# EAGLE design MainBoard (EAGLE 9.6.2)

## Sheet 1 of 4
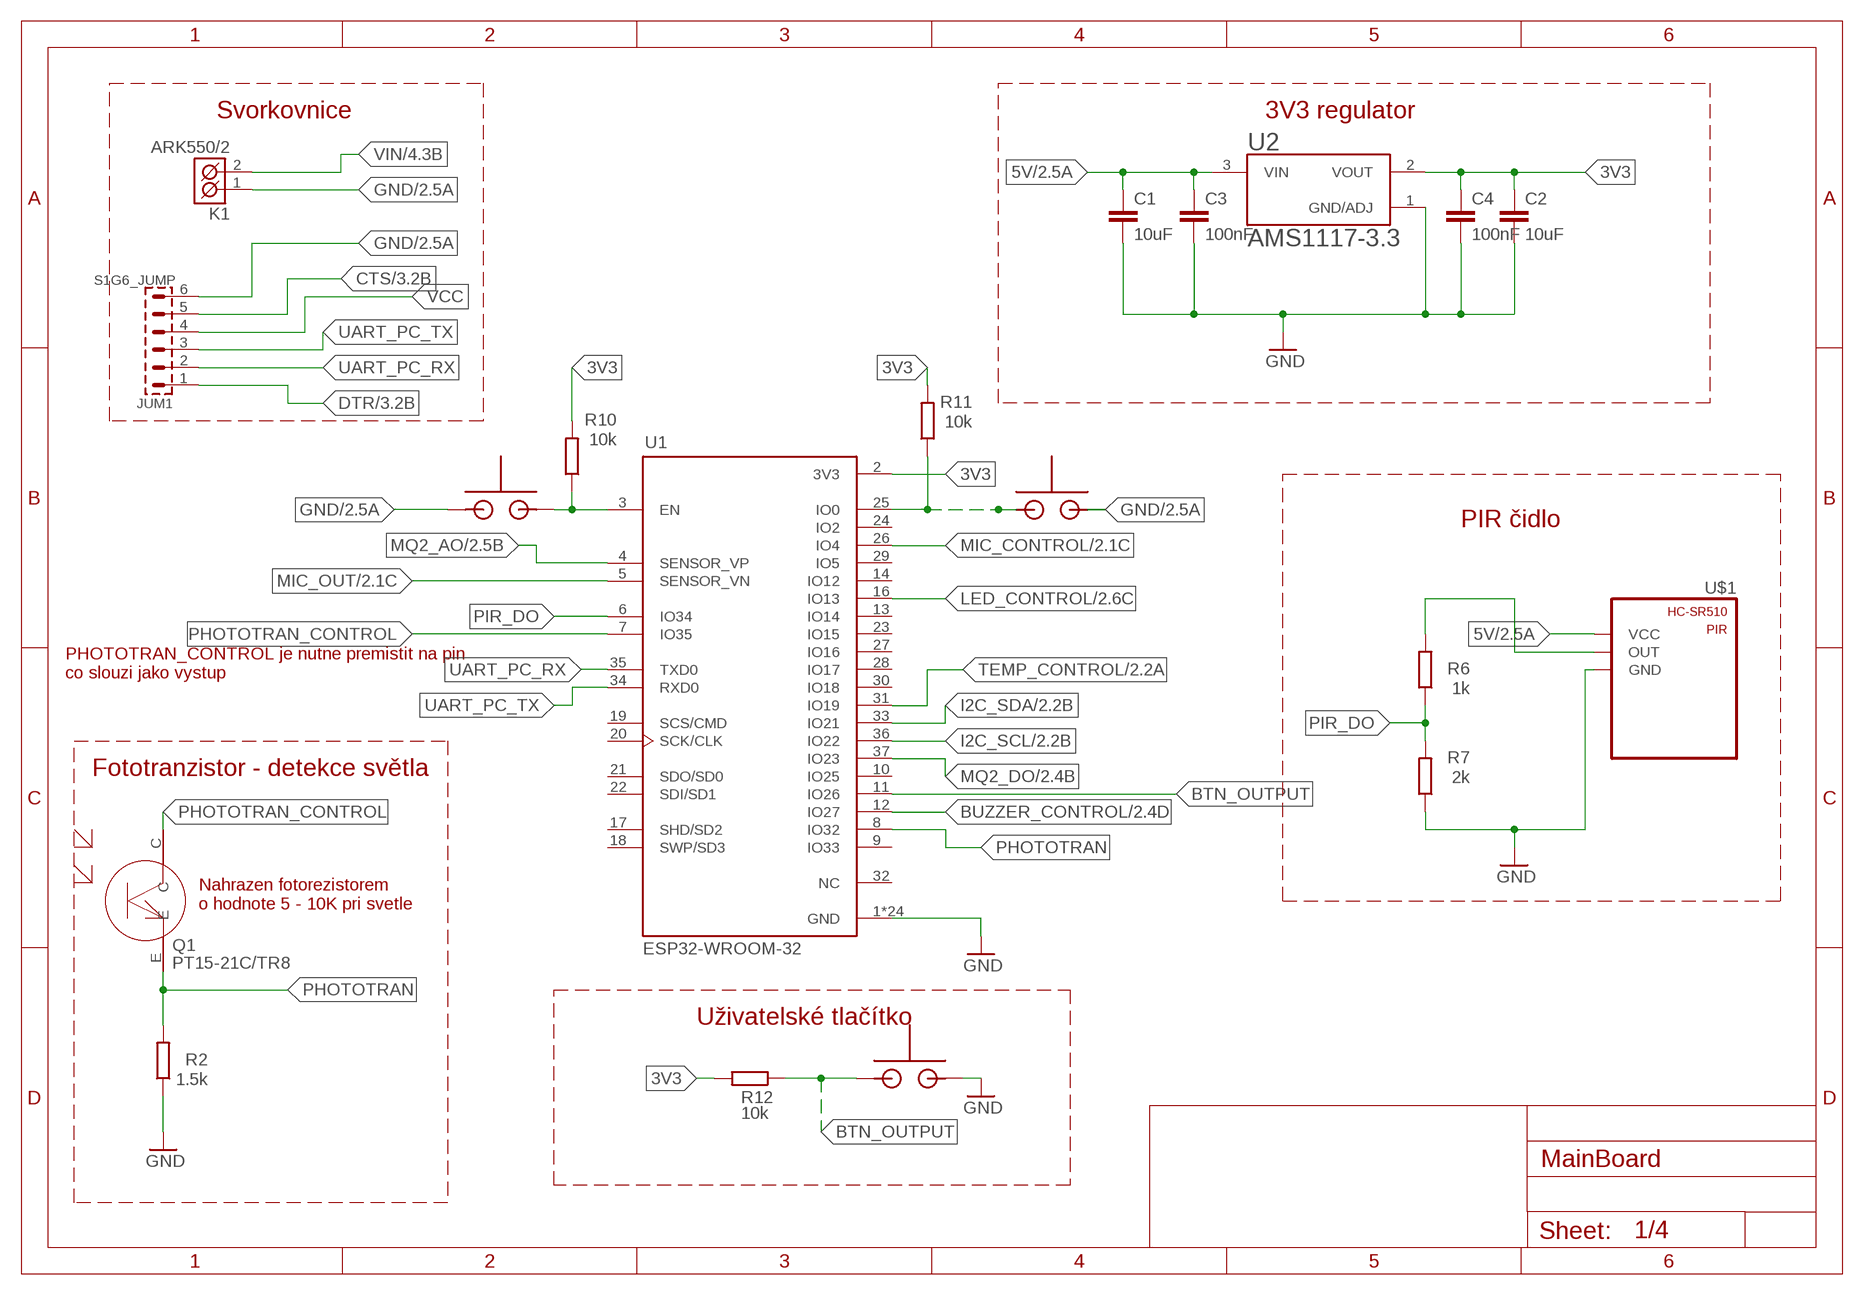
[diagram p0: schematic, sheet 1]

### Parts
C1  10uF  C-EUC0805  [C0805]
C2  10uF  C-EUC0805  [C0805]
C3  100nF  C-EUC0805  [C0805]
C4  100nF  C-EUC0805  [C0805]
JUM1  S1G6_JUMP  [S1G6_JUM]
K1  ARK550/2  [ARK550/2]
Q1  PT15-21C/TR8  [PT15-21C/TR8]
R2  1.5k  R-EU_R0805  [R0805]
R6  1k  R-EU_R0805  [R0805]
R7  2k  R-EU_R0805  [R0805]
R10  10k  R-EU_R0805  [R0805]
R11  10k  R-EU_R0805  [R0805]
R12  10k  R-EU_R0805  [R0805]
U1  ESP32-WROOM-32  [MODULE_ESP32-WROOM-32]
U2  AMS1117-3.3  [SOT229P700X180-4N]
U$1  HC-SR501  [HC-SR501]
U$6  TS6604B  [TS6604B]
U$7  TS6604B  [TS6604B]
U$8  TS6604B  [TS6604B]

### Nets
3V3: C2.1 C4.1 R10.2 R11.2 R12.2 U1.2(3V3) U2.2(VOUT)
5V: C1.1 C3.1 U2.3(VIN) U$1.VCC ; also sheet 2,4
BTN_OUTPUT: R12.1 U1.11(IO26) U$8.+
BUZZER_CONTROL: U1.12(IO27) ; also sheet 2
CTS: JUM1.5 ; also sheet 3
DTR: JUM1.1 ; also sheet 3
EN: R10.1 U1.3(EN) U$6.+ ; also sheet 3
GND: C1.2 C2.2 C3.2 C4.2 JUM1.6 K1.1(K1) R2.1 R7.1 U1.1(GND) U1.15(GND) U1.38(GND) U1.39_1(GND) U1.39_2(GND) U1.39_3(GND) U1.39_4(GND) U1.39_5(GND) U1.39_6(GND) U1.39_7(GND) U1.39_8(GND) U1.39_9(GND) U1.39_10(GND) U1.39_11(GND) U1.39_12(GND) U1.39_13(GND) U1.39_14(GND) U1.39_15(GND) U1.39_16(GND) U1.39_17(GND) U1.39_18(GND) U1.39_19(GND) U1.39_20(GND) U1.39_21(GND) U2.1(GND/ADJ) U$1.GND U$6.- U$7.- U$8.- ; also sheet 2,4
I2C_SCL: U1.36(IO22) ; also sheet 2
I2C_SDA: U1.33(IO21) ; also sheet 2
IO0: R11.1 U1.25(IO0) U$7.+ ; also sheet 3
LED_CONTROL: U1.16(IO13) ; also sheet 2
MIC_CONTROL: U1.26(IO4) ; also sheet 2
MIC_OUT: U1.5(SENSOR_VN) ; also sheet 2
MQ2_AO: U1.4(SENSOR_VP) ; also sheet 2
MQ2_DO: U1.37(IO23) ; also sheet 2
N$6: R6.2 U$1.OUT
PHOTOTRAN: Q1.E R2.2 U1.8(IO32)
PHOTOTRAN_CONTROL: Q1.C U1.7(IO35)
PIR_DO: R6.1 R7.2 U1.6(IO34)
TEMP_CONTROL: U1.31(IO19) ; also sheet 2
UART_PC_RX: JUM1.2 U1.35(TXD0)
UART_PC_TX: JUM1.3 U1.34(RXD0)
VCC: JUM1.4
VIN: K1.2(K2) ; also sheet 4
Unconnected: U1.9(IO33) U1.10(IO25) U1.13(IO14) U1.14(IO12) U1.17(SHD/SD2) U1.18(SWP/SD3) U1.19(SCS/CMD) U1.20(SCK/CLK) U1.21(SDO/SD0) U1.22(SDI/SD1) U1.23(IO15) U1.24(IO2) U1.27(IO16) U1.28(IO17) U1.29(IO5) U1.30(IO18) U1.32(NC)

### Notes on the sheet
- Svorkovnice | 3V3 regulator
- PIR čidlo
- PHOTOTRAN_CONTROL je nutne premistit na pin
  co slouzi jako vystup
- Fototranzistor - detekce světla
- Nahrazen fotorezistorem
  o hodnote 5 - 10K pri svetle
- Uživatelské tlačítko

## Sheet 2 of 4
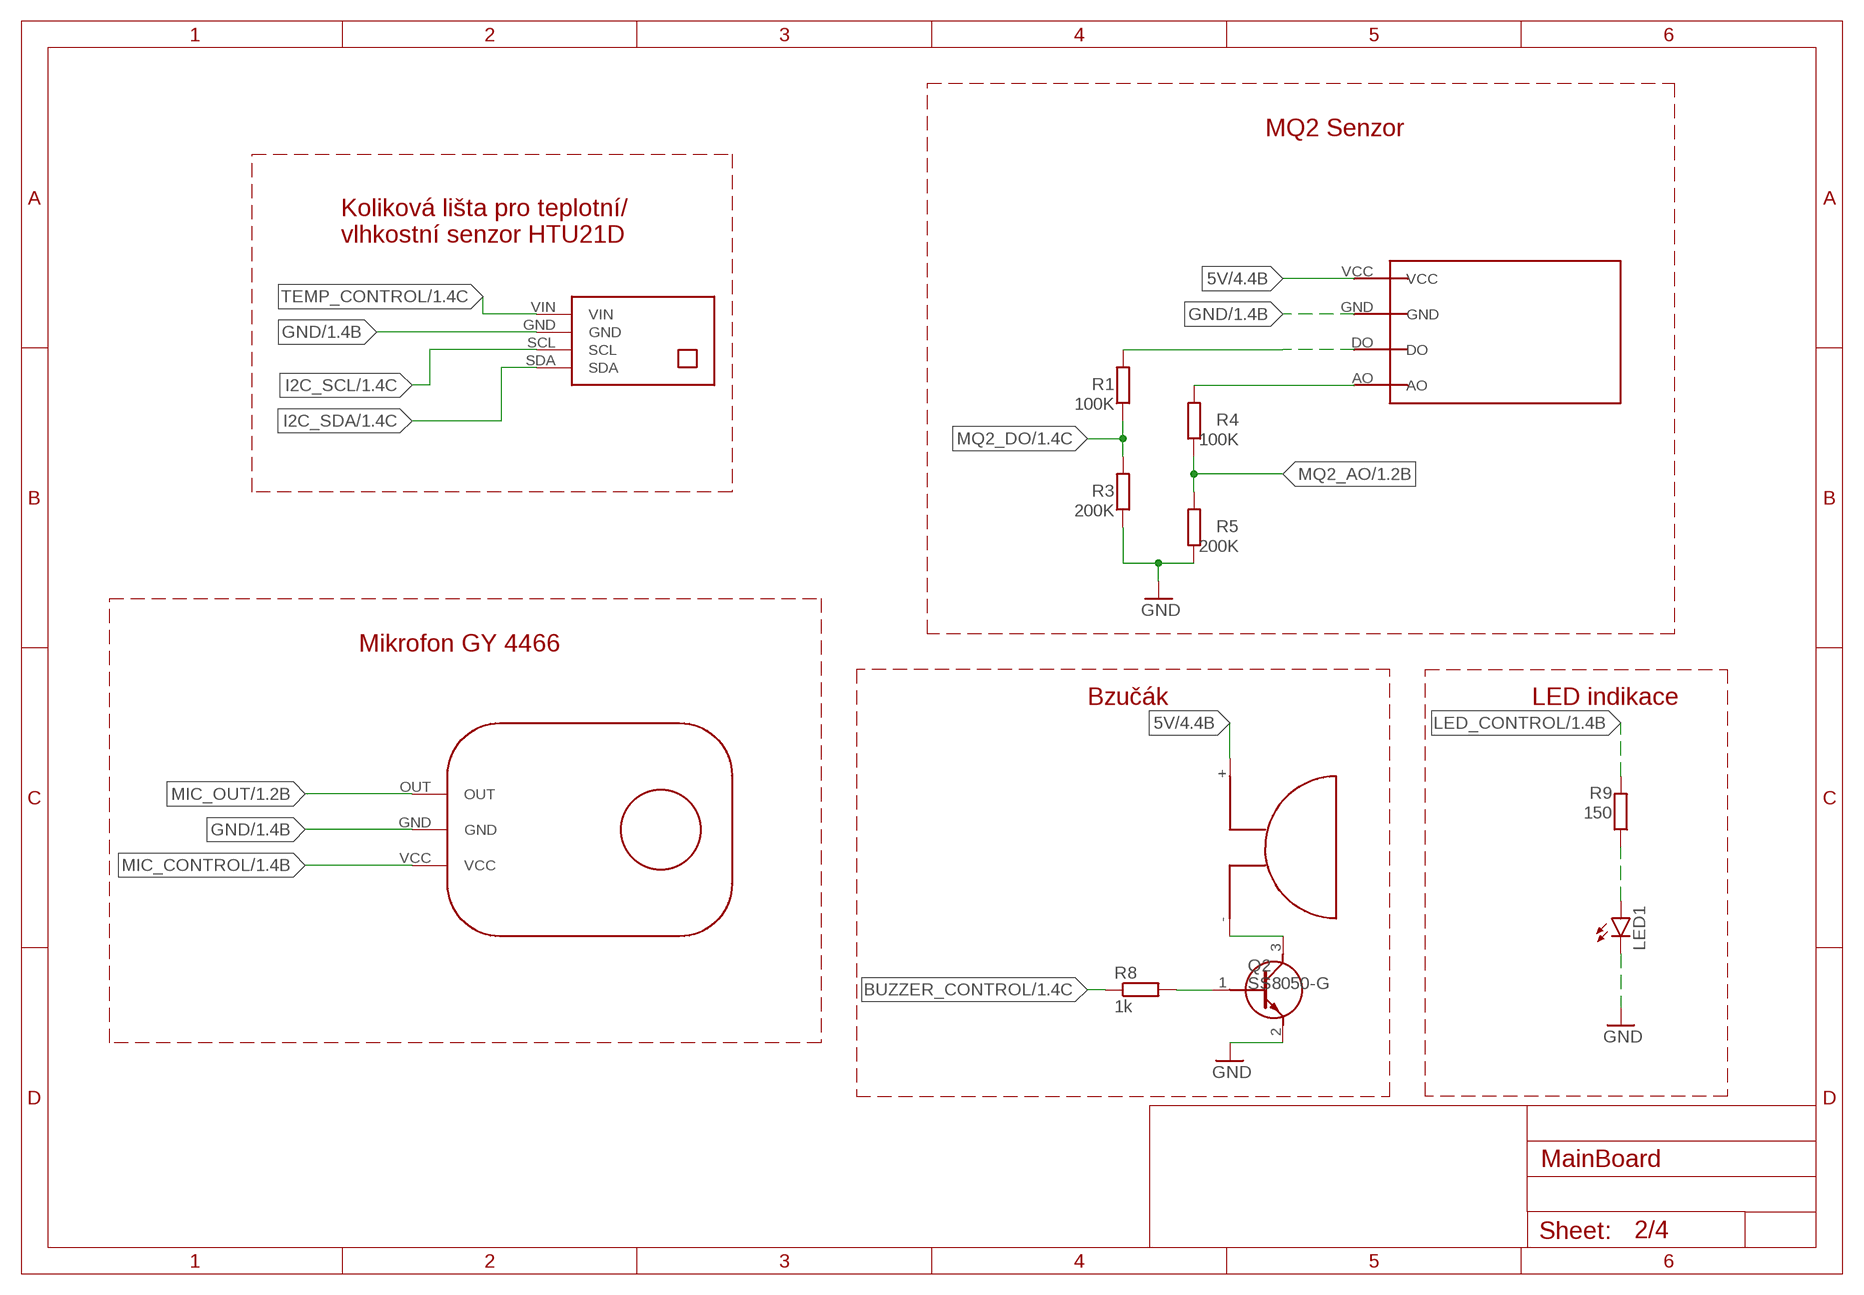
[diagram p1: schematic, sheet 2]

### Parts
LED1  LEDCHIP-LED0805  [CHIP-LED0805]
Q2  SS8050-G  [SOT95P240X115-3N]
R1  100K  R-EU_R0805  [R0805]
R3  200K  R-EU_R0805  [R0805]
R4  100K  R-EU_R0805  [R0805]
R5  200K  R-EU_R0805  [R0805]
R8  1k  R-EU_R0805  [R0805]
R9  150  R-EU_R0805  [R0805]
U$2  MQ2  [MQ2]
U$3  GY4466  [GY4466]
U$4  BUZZER  [BUZZER]
U$5  HTU21D  [HTU21D]

### Nets
5V: U$2.VCC U$4.+ ; also sheet 1,4
BUZZER_CONTROL: R8.1 ; also sheet 1
GND: LED1.C Q2.2(E) R3.1 R5.1 U$2.GND U$3.GND U$5.GND ; also sheet 1,4
I2C_SCL: U$5.SCL ; also sheet 1
I2C_SDA: U$5.SDA ; also sheet 1
LED_CONTROL: R9.2 ; also sheet 1
MIC_CONTROL: U$3.VCC ; also sheet 1
MIC_OUT: U$3.OUT ; also sheet 1
MQ2_AO: R4.1 R5.2 ; also sheet 1
MQ2_DO: R1.1 R3.2 ; also sheet 1
N$1: Q2.3(C) U$4.-
N$2: Q2.1(B) R8.2
N$3: R1.2 U$2.DO
N$4: R4.2 U$2.AO
N$5: LED1.A R9.1
TEMP_CONTROL: U$5.VIN ; also sheet 1

### Notes on the sheet
- MQ2 Senzor
- Koliková lišta pro teplotní/
  vlhkostní senzor HTU21D
- Mikrofon GY 4466
- Bzučák | LED indikace

## Sheet 3 of 4
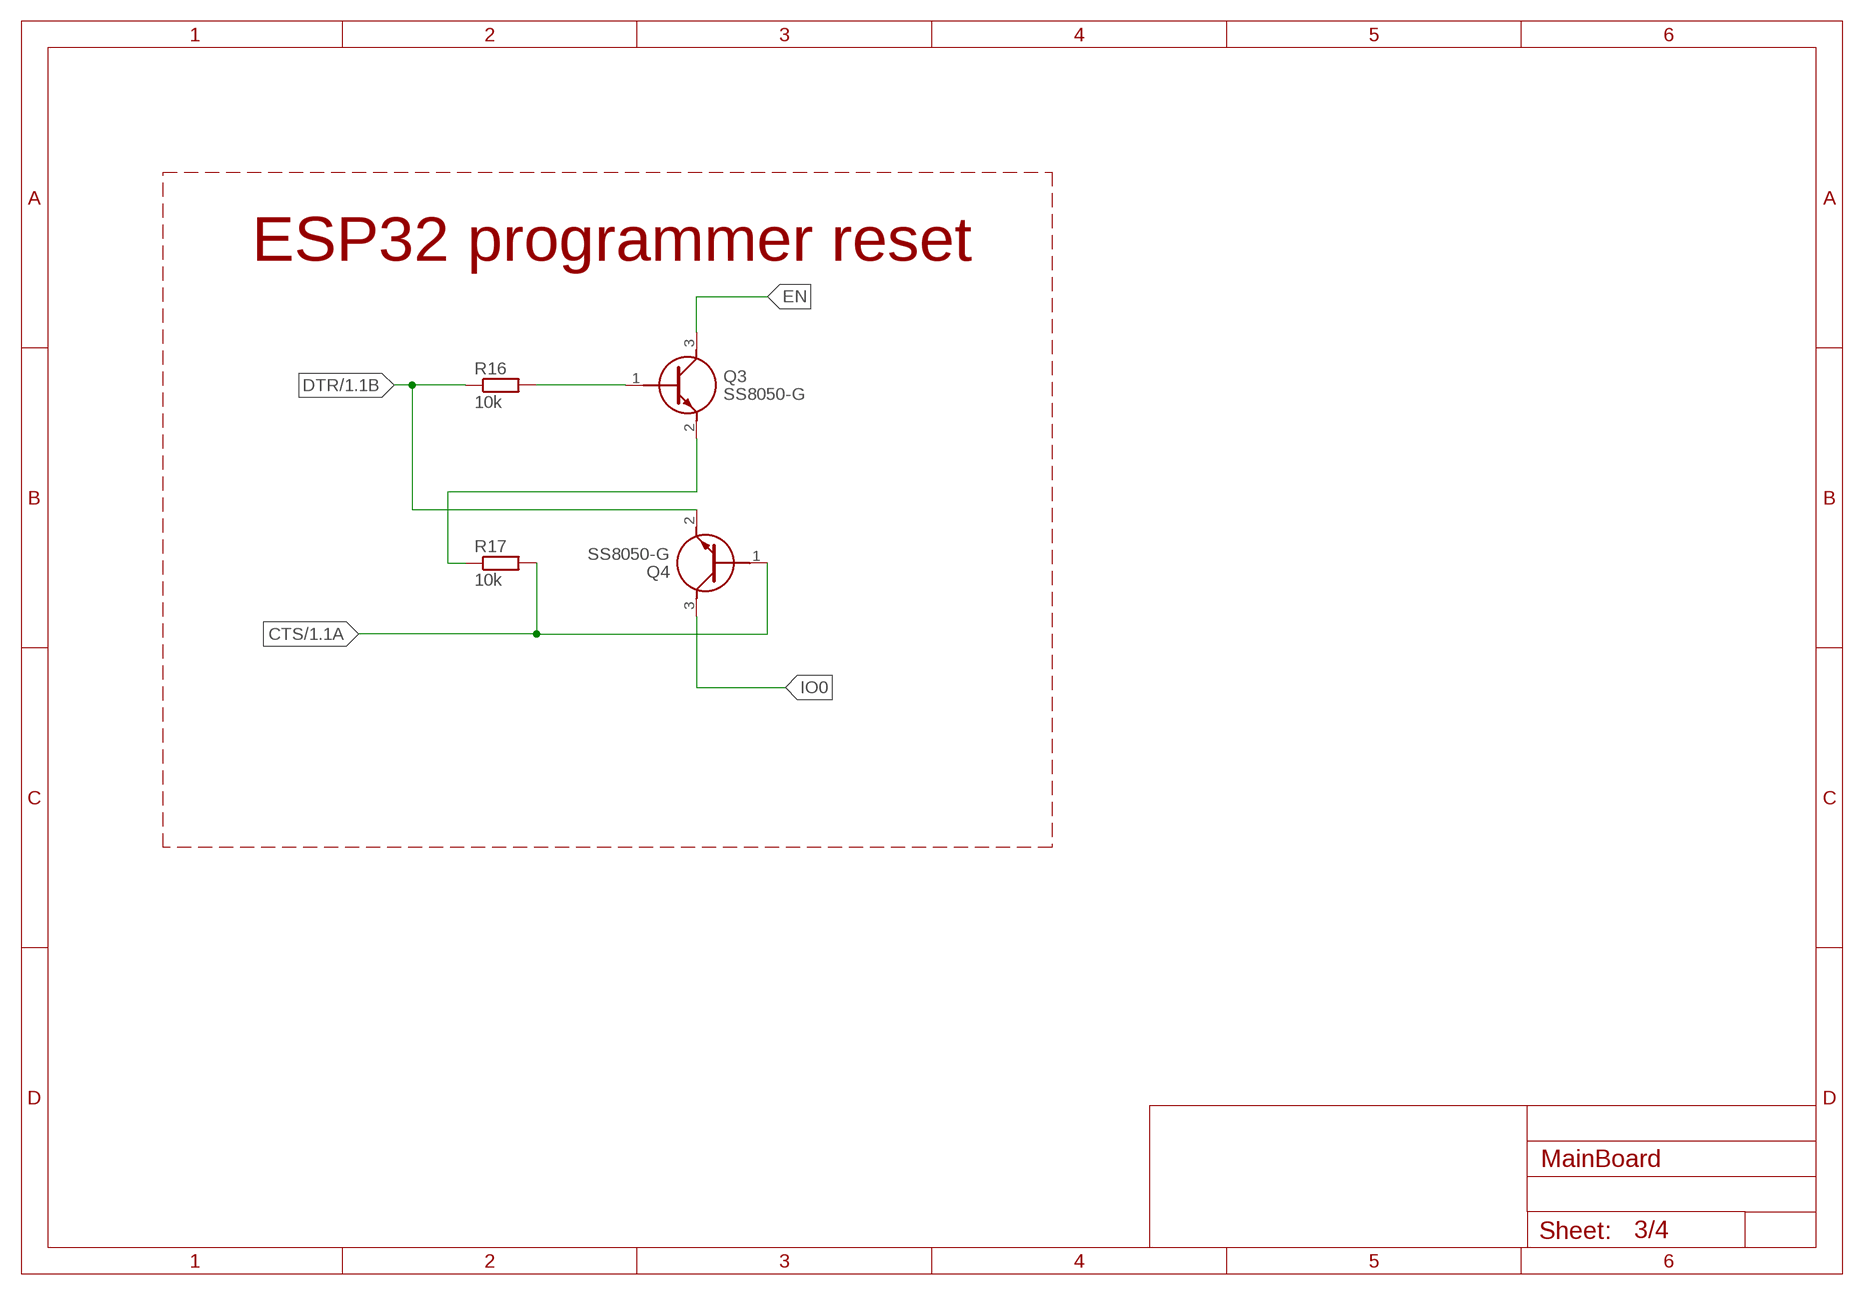
[diagram p2: schematic, sheet 3]

### Parts
Q3  SS8050-G  [SOT95P240X115-3N]
Q4  SS8050-G  [SOT95P240X115-3N]
R16  10k  R-EU_R0805  [R0805]
R17  10k  R-EU_R0805  [R0805]

### Nets
CTS: Q4.1(B) R17.2 ; also sheet 1
DTR: Q4.2(E) R16.1 ; also sheet 1
EN: Q3.3(C) ; also sheet 1
IO0: Q4.3(C) ; also sheet 1
N$13: Q3.1(B) R16.2
N$15: Q3.2(E) R17.1

### Notes on the sheet
- ESP32 programmer reset

## Sheet 4 of 4
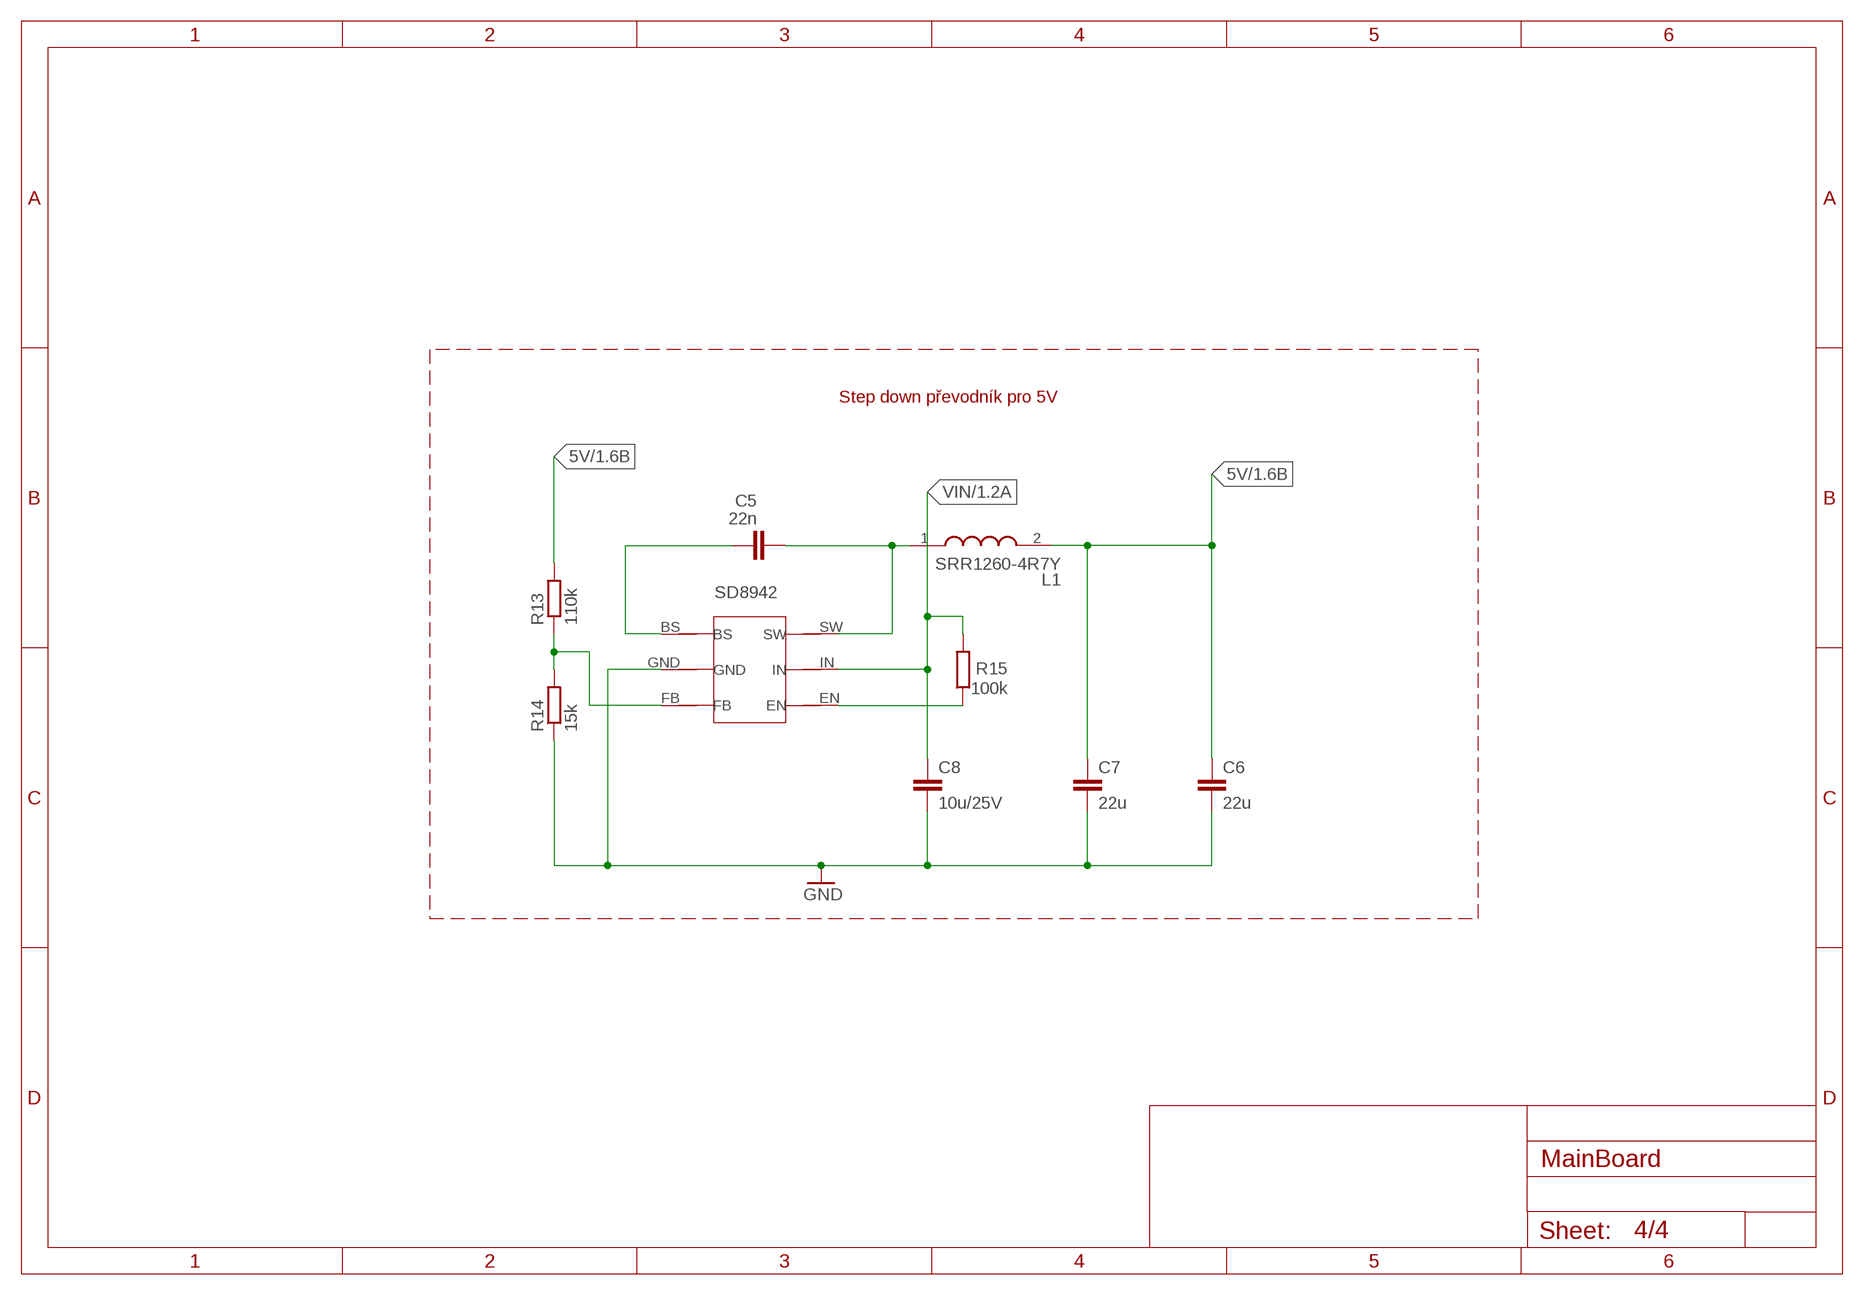
[diagram p3: schematic, sheet 4]

### Parts
C5  22n  C-EUC0805  [C0805]
C6  22u  C-EUC0805  [C0805]
C7  22u  C-EUC0805  [C0805]
C8  10u/25V  C-EUC0805  [C0805]
L1  SRR1260-4R7Y  [SRR12604R7Y]
R13  110k  R-EU_R0805  [R0805]
R14  15k  R-EU_R0805  [R0805]
R15  100k  R-EU_R0805  [R0805]
U$9  SD8942  [SD8942]

### Nets
5V: C6.1 C7.1 L1.2 R13.2 ; also sheet 1,2
GND: C6.2 C7.2 C8.2 R14.1 U$9.GND ; also sheet 1,2
N$9: C5.1 U$9.BS
N$10: C5.2 L1.1 U$9.SW
N$11: R15.1 U$9.EN
N$12: R13.1 R14.2 U$9.FB
VIN: C8.1 R15.2 U$9.IN ; also sheet 1

### Notes on the sheet
- Step down převodník pro 5V
- SD8942

## Library data of the parts
C1-C8 = rcl:C-EU: CAPACITOR, European symbol; SPICEPREFIX: C
JUM1 = #PaJa_konektory:S1G6_JUMP: Radove konektory - koliky - 6x
K1 = #PaJa_konektory:ARK550/2: Svorkovnice - roztec 3,5mm - dvojita
L1 = SRR1260-4R7Y:SRR1260-4R7Y: Inductor Power Shielded Wirewound 4.7uH 30% 100KHz 19Q-Factor Ferrite 6.8A 15.5mOhm DCR T/R Source: Datasheet <https://componentsearchengine.com/Datasheets/1/SRR1260-4R7Y.pdf>; DESCRIPTION: Inductor Power Shielded Wirewound 4.7uH 30% 100KHz 19Q-Factor Ferrite 6.8A 15.5mOhm DCR T/R; HEIGHT: 6.5mm; MANUFACTURER_NAME: Bourns; MANUFACTURER_PART_NUMBER: SRR1260-4R7Y; MOUSER_PART_NUMBER: 652-SRR1260-4R7Y; MOUSER_PRICE-STOCK: https://www.mouser.co.uk/ProductDetail/Bourns/SRR1260-4R7Y?qs=meVWcSOgEr6HGQUyq2JiMQ%3D%3D
LED1 = led:LED: LED OSRAM: - CHIPLED LG R971, LG N971, LY N971, LG Q971, LY Q971, LO R971, LY R971 LH N974, LH R974 LS Q976, LO Q976, LY Q976 LO Q996 - Hyper CHIPLED LW Q18S LB Q993, LB Q99A, LB R99A - SideLED LS A670, LO A670, LY A670, LG A670, LP A670 LB A673, LV A673, LT A673, LW A673 LH A674 LY A675 LS A676, LA A676, LO A676, LY A676, LW A676 LS A679, LY A679, LG A679 - Hyper Micro SIDELED® LS Y876, LA Y876, LO Y876, LY Y876 LT Y87S - SmartLED LW L88C, LW L88S LB L89C, LB L89S, LG L890 LS L89K, LO L89K, LY L89K LS L896, LA L896, LO L896, LY L896 - TOPLED LS T670, LO T670, LY T670, LG T670, LP T670 LSG T670, LSP T670, LSY T670, LOP T670, LYG T670 LG T671, LOG T671, LSG T671 LB T673, LV T673, LT T673, LW T673 LH T674 LS T676, LA T676, LO T676, LY T676, LB T676, LH T676, LSB T676, LW T676 LB T67C, LV T67C, LT T67C, LS T67K, LO T67K, LY T67K, LW E67C LS E67B, LA E67B, LO E67B, LY E67B, LB E67C, LV E67C, LT E67C LW T67C LS T679, LY T679, LG T679 LS T770, LO T770, LY T770, LG T770, LP T770 LB T773, LV T773, LT T773, LW T773 LH T774 LS E675, LA E675, LY E675, LS T675 LS T776, LA T776, LO T776, LY T776, LB T776 LHGB T686 LT T68C, LB T68C - Hyper Mini TOPLED® LB M676 - Mini TOPLED Santana® LG M470 LS M47K, LO M47K, LY M47K Source: http://www.osram.convergy.de LUXEON: - LUMILED® LXK2-PW12-R00, LXK2-PW12-S00, LXK2-PW14-U00, LXK2-PW14-V00 LXK2-PM12-R00, LXK2-PM12-S00, LXK2-PM14-U00 LXK2-PE12-Q00, LXK2-PE12-R00, LXK2-PE12-S00, LXK2-PE14-T00, LXK2-PE14-U00 LXK2-PB12-K00, LXK2-PB12-L00, LXK2-PB12-M00, LXK2-PB14-N00, LXK2-PB14-P00, LXK2-PB14-Q00 LXK2-PR12-L00, LXK2-PR12-M00, LXK2-PR14-Q00, LXK2-PR14-R00 LXK2-PD12-Q00, LXK2-PD12-R00, LXK2-PD12-S00 LXK2-PH12-R00, LXK2-PH12-S00 LXK2-PL12-P00, LXK2-PL12-Q00, LXK2-PL12-R00 Source: www.luxeon.com KINGBRIGHT: KA-3528ASYC Source: www.kingbright.com
Q1 = myParts:PT15-21C/TR8
Q2-Q4 = SS8050-G:SS8050-G: Bipolar Transistors - BJT NPN TRANSISTOR 1.5A 40V Source: Datasheet <https://datasheet.datasheetarchive.com/originals/distributors/DKDS-12/229454.pdf>; DESCRIPTION: Bipolar Transistors - BJT NPN TRANSISTOR 1.5A 40V; HEIGHT: 1.15mm; MANUFACTURER_NAME: Comchip Technology; MANUFACTURER_PART_NUMBER: SS8050-G; MOUSER_PART_NUMBER: 750-SS8050-G; MOUSER_PRICE-STOCK: https://www.mouser.co.uk/ProductDetail/Comchip-Technology/SS8050-G?qs=LLUE9lz1YbcHg%252BWLMAtcrQ%3D%3D
R1-R17 = rcl:R-EU_: RESISTOR, European symbol; SPICEPREFIX: R
U1 = ESP32-WROOM-32:ESP32-WROOM-32: Check availability <https://pricing.snapeda.com/parts/ESP32-WROOM-32/Espressif%20Systems/view-part?ref=eda>; AVAILABILITY: Not in stock; CHECK_PRICES: https://www.snapeda.com/parts/ESP32-WROOM-32/Espressif+Systems/view-part/?ref=eda; DESCRIPTION: Bluetooth, WiFi 802.11b/g/n, Bluetooth v4.2 +EDR, Class 1, 2 and 3 Transceiver Module 2.4GHz ~ 2.5GHz Antenna Not Included, U.FL Surface Mount; MF: Espressif Systems; MP: ESP32-WROOM-32; PACKAGE: Non Standard Espressif Systems; PRICE: None; SNAPEDA_LINK: https://www.snapeda.com/parts/ESP32-WROOM-32/Espressif+Systems/view-part/?ref=snap
U2 = AMS1117-3.3:AMS1117-3.3: Check availability <https://pricing.snapeda.com/parts/AMS1117-3.3/Advanced%20Monolithic%20Systems/view-part?ref=eda>; AVAILABILITY: Not in stock; CHECK_PRICES: https://www.snapeda.com/parts/AMS1117-3.3/Advanced+Monolithic+Systems/view-part/?ref=eda; DESCRIPTION: Sot223/Pkg 1-Amp 3.3-Volt Low Drop Out Voltage Regulatator; MF: Advanced Monolithic Systems; MP: AMS1117-3.3; PACKAGE: SOT-223 Seeed Technology; PRICE: None; SNAPEDA_LINK: https://www.snapeda.com/parts/AMS1117-3.3/Advanced+Monolithic+Systems/view-part/?ref=snap
U$1 = Sensors_PIR_Lux:HC-SR501: PIR Module HC-SR501
U$2 = myParts:MQ2
U$3 = myParts:GY4466: mikrofon GY466
U$4 = myParts:BUZZER: generický bzučák o průměru 12mm
U$5 = myParts:HTU21D: htu21d
U$6-U$8 = myParts:TS6604B: smd tlacitko
U$9 = myParts:SD8942: step-down

## Board
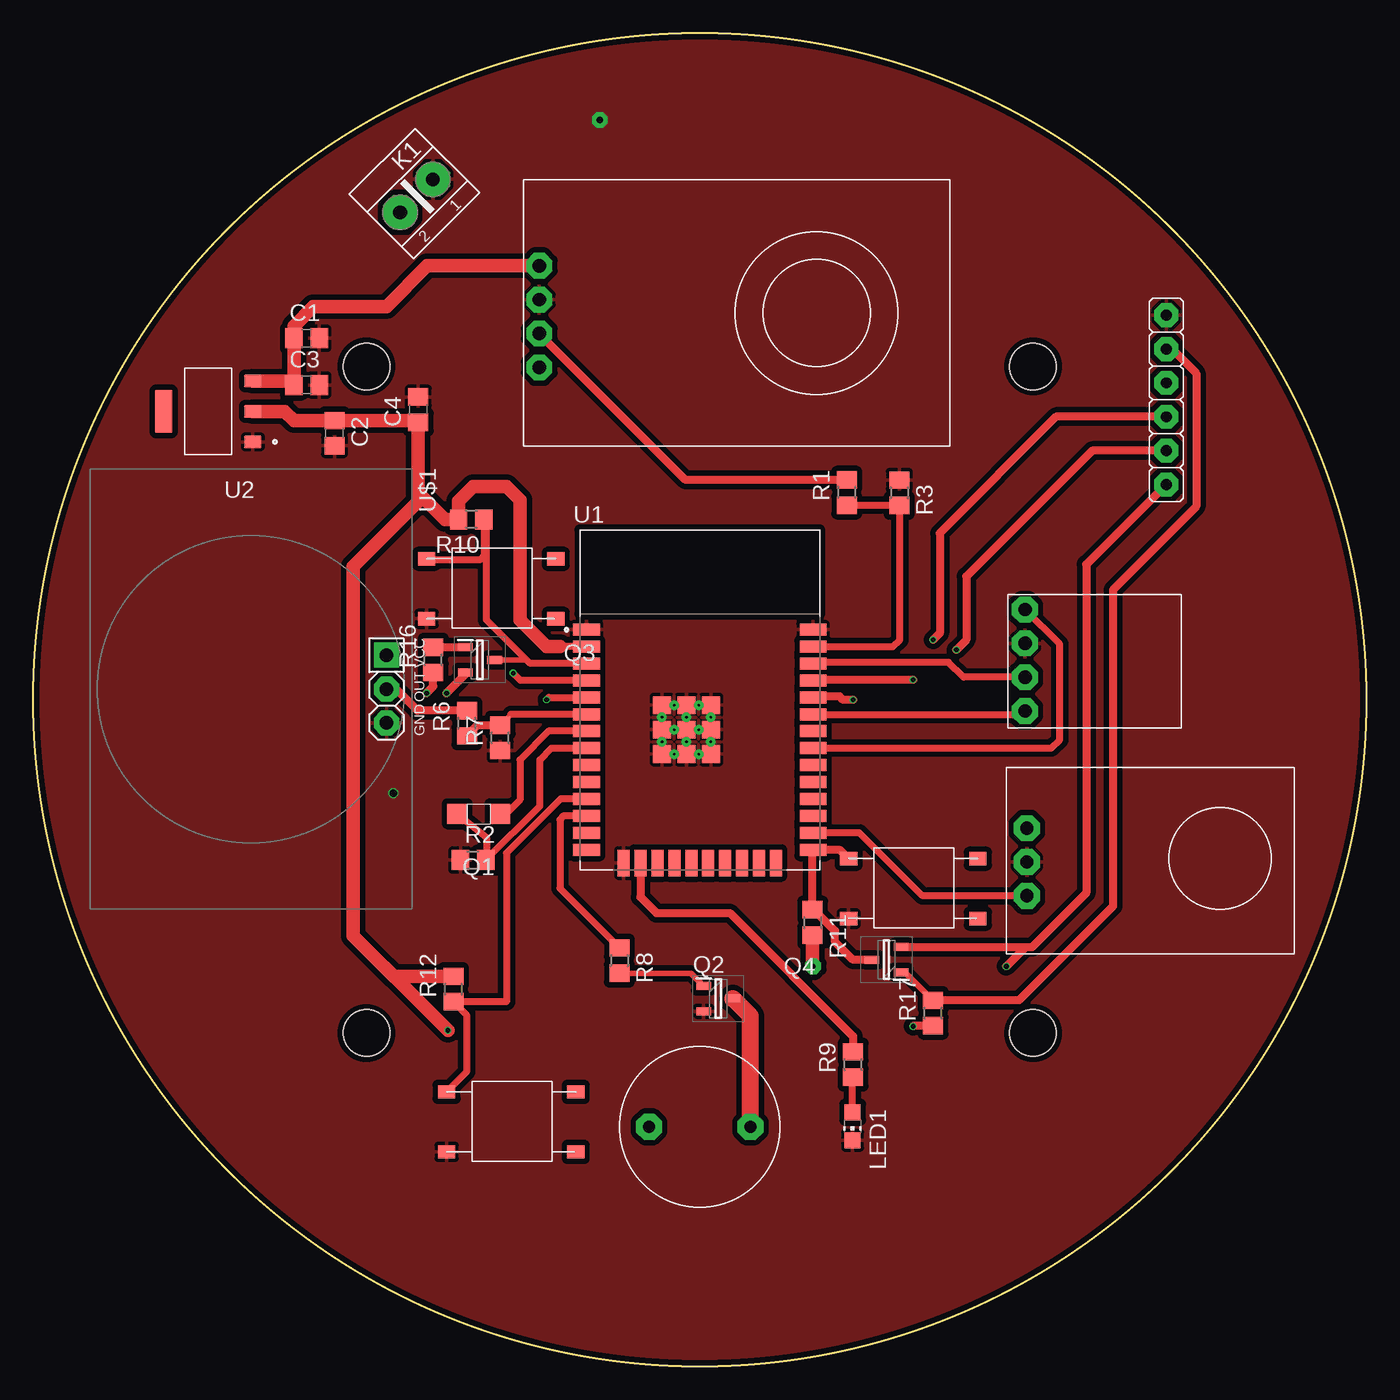
[diagram p4: board, top side]
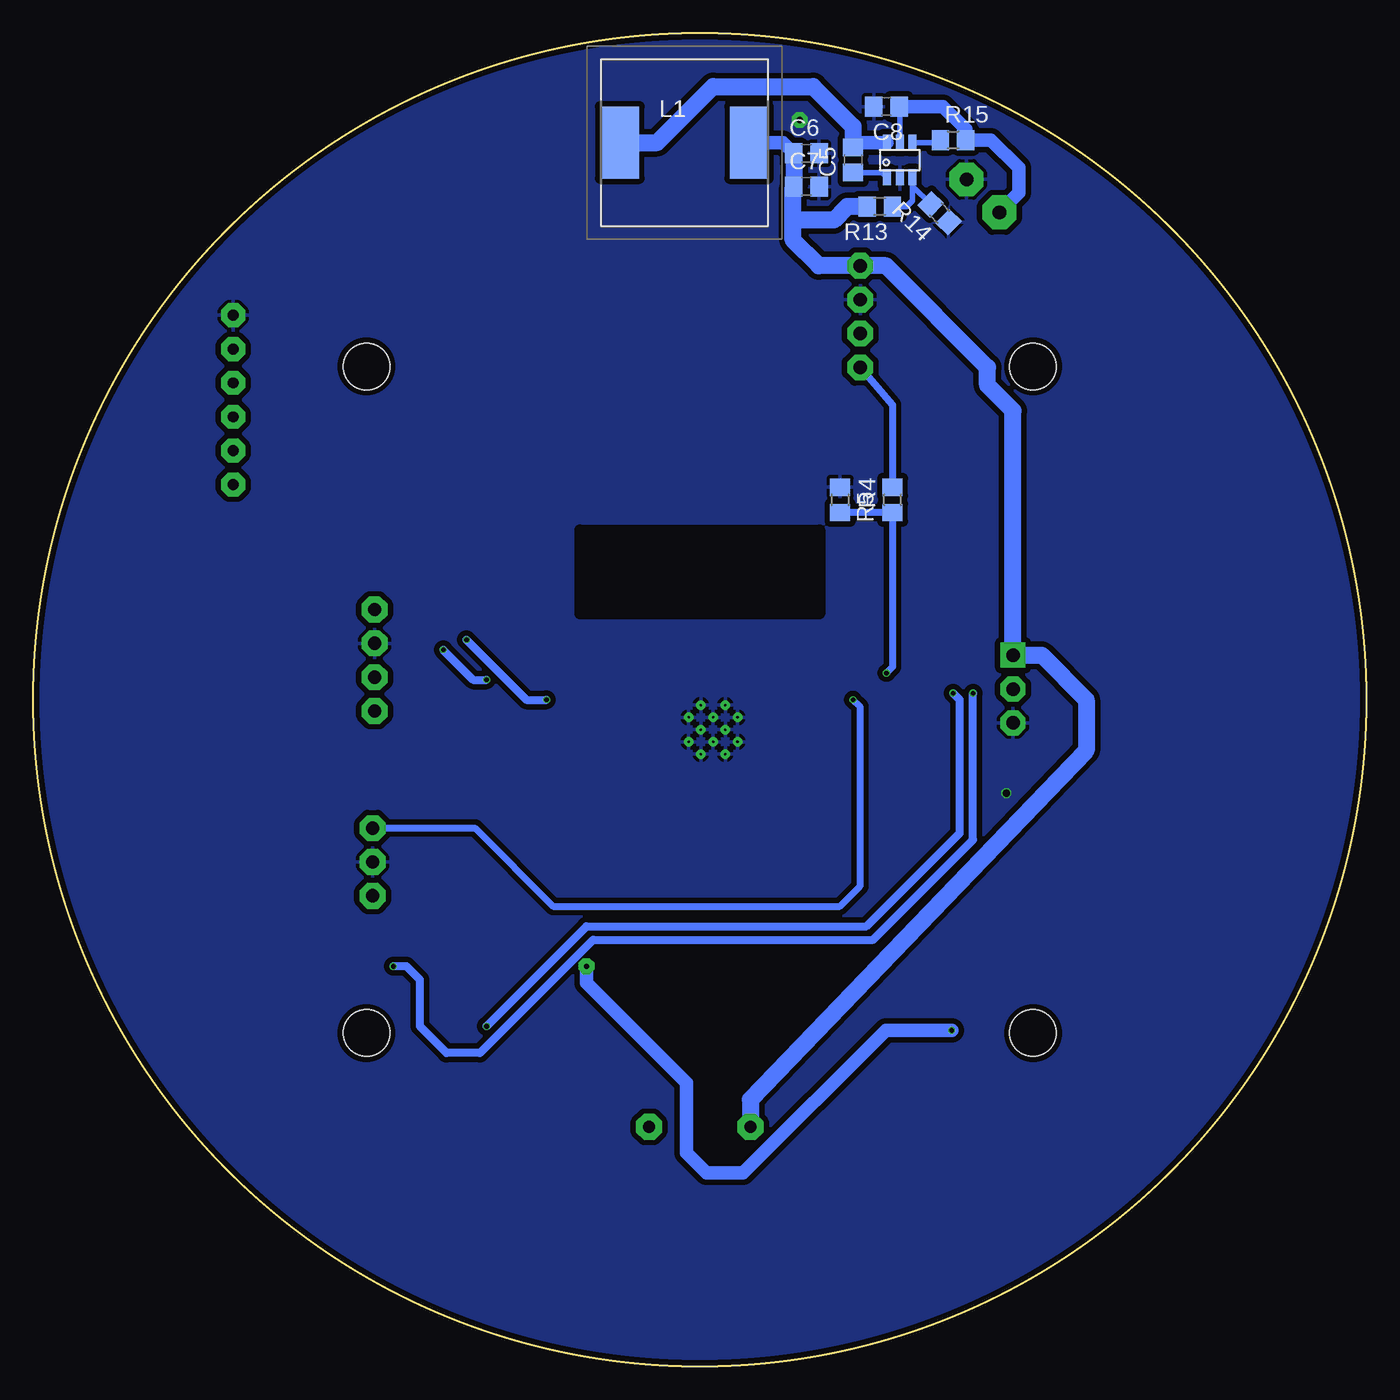
[diagram p5: board, bottom side, seen from below]

Size 100 x 100 mm. Coordinates in mm from the lower left corner, seen from the top.
Outline: circle at 50,50 radius 50
Copper layers (1*16): Top 0.035mm / dielectric 1.6mm / Bottom 0.035mm
Design rules "jlcpcb-2layers": minimum track width 5mil, minimum drill 0.3mm, track to track 5mil, track to pad 5mil, pad to pad 5mil, via to via 5mil, smd to smd 5mil, copper to edge 0.2mm, drill to drill 6mil, minimum pad ring 10mil, minimum via ring 3mil, stop-mask expansion 4mil, vias tented up to drill 0mil, thermal gap 10mil
Holes 3.5 mm at 75,75 25,75 75,25 25,25

### Footprints (pad centres in the part's own frame; a part is rotated, then mirrored left to right if it is on the bottom)
C0805 = smd 1.3 x 1.5: 1 -0.95,0; 2 0.95,0
S1G6_JUM = drill 0.813 pad 1.778 octagon: 1 -6.35,0; 2 -3.81,0; 3 -1.27,0; 4 1.27,0; 5 3.81,0; 6 6.35,0
ARK550/2 = drill 1.016 pad 2.54 octagon: 1 0,0; 2 3.493,0
SRR12604R7Y = smd 2.9 x 5.4: 1 -4.85,0; 2 4.85,0
CHIP-LED0805 = smd 1.2 x 1.2: A 0,-1.05; C 0,1.05
PT15-21C/TR8 = smd 1.5 x 1.5: C -1.6,0; E 1.6,0
SOT95P240X115-3N = smd 1.1 x 0.6: 1 -1.1,0.95; 2 -1.1,-0.95; 3 1.1,0
R0805 = smd 1.3 x 1.5: 1 -0.95,0; 2 0.95,0
MODULE_ESP32-WROOM-32 = smd 2 x 0.9: 1 -8.5,5.26; 2 -8.5,3.99; 3 -8.5,2.72; 4 -8.5,1.45; 5 -8.5,0.18; 6 -8.5,-1.09; 7 -8.5,-2.36; 8 -8.5,-3.63; 9 -8.5,-4.9; 10 -8.5,-6.17; 11 -8.5,-7.44; 12 -8.5,-8.71; 13 -8.5,-9.98; 14 -8.5,-11.25; 25 8.5,-11.25; 26 8.5,-9.98; 27 8.5,-8.71; 28 8.5,-7.44; 29 8.5,-6.17; 30 8.5,-4.9; 31 8.5,-3.63; 32 8.5,-2.36; 33 8.5,-1.09; 34 8.5,0.18; 35 8.5,1.45; 36 8.5,2.72; 37 8.5,3.99; 38 8.5,5.26 | smd 0.9 x 2: 15 -5.715,-12.25; 16 -4.445,-12.25; 17 -3.175,-12.25; 18 -1.905,-12.25; 19 -0.635,-12.25; 20 0.635,-12.25; 21 1.905,-12.25; 22 3.175,-12.25; 23 4.445,-12.25; 24 5.715,-12.25 | smd 1.33 x 1.33: 39_1 -2.835,-0.405; 39_2 -1,-0.405; 39_3 0.835,-0.405; 39_4 -2.835,-2.24; 39_5 -1,-2.24; 39_6 0.835,-2.24; 39_7 -2.835,-4.075; 39_8 -1,-4.075; 39_9 0.835,-4.075 | drill 0.2 pad 0.3: 39_10 -1.917,-0.405; 39_11 -0.083,-0.405; 39_12 -2.835,-1.323; 39_13 -1,-1.323; 39_14 0.835,-1.323; 39_15 -1.917,-2.24; 39_16 -0.083,-2.24; 39_17 -2.835,-3.158; 39_18 -1,-3.158; 39_19 0.835,-3.158; 39_20 -1.917,-4.075; 39_21 -0.083,-4.075
SOT229P700X180-4N = smd 1.31 x 0.93: 1 -3.345,2.29; 2 -3.345,0; 3 -3.345,-2.29 | smd 1.31 x 3.24: 4 3.345,0
HC-SR501 = drill 1.016 pad 1.88 octagon: GND 2.54,10.795; OUT 0,10.795 | drill 1.016 pad 1.88 square: VCC -2.54,10.795
MQ2 = drill 1 pad 1.93 octagon: AO 1.19,5.92; DO 1.19,8.46; GND 1.19,11; VCC 1.19,13.54
GY4466 = drill 1 pad 1.93 octagon: GND 7.112,1.524; OUT 4.572,1.524; VCC 9.652,1.524
BUZZER = drill 0.9 pad 1.93 octagon: + -3.8,0; - 3.8,0
HTU21D = drill 1 pad 1.93 octagon: GND 1.27,6.35; SCL 1.27,3.81; SDA 1.27,1.27; VIN 1.27,8.89
TS6604B = smd 1.3 x 1: + 0,4.5; - 0,0; P$2 9.7,0; P$4 9.7,4.5
SD8942 = smd 0.6 x 1.2: BS -0.95,-1.3; EN 0.95,1.3; FB 0.95,-1.3; GND 0,-1.3; IN 0,1.3; SW -0.95,1.3

### Placement (x,y rotation side)
C1  20.5,77.12 0 top
C2  22.6,70 270 top
C3  20.5,73.62 0 top
C4  28.88,71.77 90 top
C5  38.5,90.5 90 bottom
C6  42,91 0 bottom
C7  42,88.5 0 bottom
C8  36,94.5 180 bottom
JUM1  85,72.5 90 top
K1  29.99,89.04 225 top
L1  51.15,91.8 0 bottom
LED1  61.47,18 180 top
Q1  33.4,41.45 180 top
Q2  51.39,27.58 0 top
Q3  33.5,53 0 top
Q4  64,30.5 180 top
R1  61.03,65.55 90 top
R2  32.99,37.97 0 top
R3  64.97,65.53 270 top
R4  35.53,65 90 bottom
R5  39.47,65 270 bottom
R6  32.53,48.23 90 top
R7  35.03,47.15 90 top
R8  43.97,30.43 270 top
R9  61.5,22.63 90 top
R10  32.86,63.53 180 top
R11  58.47,33.29 270 top
R12  31.53,28.29 90 top
R13  36.5,87 180 bottom
R14  32,86.5 135 bottom
R15  31,92 0 bottom
R16  30,53 90 top
R17  67.5,26.5 90 top
U1  50,50 0 top
U2  13.12,71.63 180 top
U$1  15.7,50.8 270 top
U$2  36.77,69.02 0 top
U$3  73.02,44.94 270 top
U$4  50,17.96 0 top
U$5  73.13,47.88 0 top
U$6  29.5,56.08 0 top
U$7  61.17,33.58 0 top
U$8  31,16.08 0 top
U$9  35,90.5 0 bottom
U$10  [A4L-LOC]  -76,-33 0 top  (outside the outline)

### Tracks (layer width: path | path; a pad name or v marks a point on that pad's centre or on a via)
3V3  (via drill 0.35, 0.35 pad 1.2)
  Top 0.203: 39,53.99 38.51,53.99 38.5,54
  Top 0.508: U1.2 39.51,53.99 39.5,54
  Top 1.016: 28.88,65.56 C4.1 28.75,70.95 C2.1 19.55,70.95 18.87,71.63 U2.2 | R12.2 27.03,29.24 26.39,29.89 | 26.39,29.89 24,32.27 24,60 28.88,64.88 28.88,65.56 | 28.88,65.56 30.91,63.53 R10.2 31.91,64.91 33,66 35.5,66 36.5,65 36.5,56 38.5,54 | 38.51,53.99 38.52,54 39.5,54 | v31.1,25.2 26.41,29.89 26.39,29.89 | v58.5,30 58.47,30.03 R11.2
  Bottom 1.016: v58.5,30 58.5,28.75 51,21.25 51,16 49.5,14.5 46.75,14.5 36.05,25.2 v31.1,25.2
5V
  Top 1.016: U$2.VCC 29.56,82.56 26.5,79.5 21,79.5 19.55,78.05 C1.1 C3.1 19.25,73.92 U2.3
  Bottom 1.016: C6.1 43.75,91.8 L1.2
  Bottom 1.27: U$4.+ 46.2,20.01 21,46.21 21,50 24.34,53.34 U$1.VCC 26.5,71.69 28.4,73.59 28.4,74.93 36.03,82.56 U$2.VCC 41.06,82.56 43,84.5 43,86 | C6.1 C7.1 43,88.45 43,86 | R13.2 38.95,87 39.95,86 43,86
BTN_OUTPUT
  Top 0.508: U1.11 39.56,42.56 35.5,38.5 35.5,27.34 R12.1 32.5,26.37 32.5,22.08 U$8.+
BUZZER_CONTROL
  Top 0.508: U1.12 39.79,41.29 39.5,41 39.5,35.85 R8.1
CTS
  Top 0.406: R17.2 65.4,29.55 Q4.1
  Top 0.61: 85.33,76.31 JUM1.5 85.44,76.31 87.25,74.5 87.25,64.5 81,58.25 81,34.5 73.95,27.45 R17.2
DTR  (via drill 0.35)
  Top 0.61: Q4.2 74.45,31.45 | JUM1.1 79,60.15 79,35.5 74.95,31.45 74.45,31.45 | v29.5,50.5 30,51 R16.1 | v73,30 74.45,31.45
  Bottom 0.61: v29.5,50.5 29.5,39.5 37,32 58,32 66.5,23.5 69,23.5 71,25.5 71,29 72,30 v73,30
EN
  Top 0.406: Q3.3 37,53 37.28,52.72
  Top 0.508: U1.3 37.28,52.72 34,56 34,63.34 R10.1 33.81,60.81 33.5,60.5 29.58,60.5 U$6.+
GND  (via drill 0.5 pad 1.15, 0.55)
  other vias: 27,43 42.5,93.5
  pour Top (isolate 0.406): 0,0 100,0 100,100 0,100
  pour Bottom (isolate 0.406): 0,0 100,0 100,100 0,100
I2C_SCL
  Top 0.508: U1.36 58.59,52.81 68.67,52.81 69.78,51.69 U$5.SCL
I2C_SDA
  Top 0.508: U1.33 74.16,48.91 U$5.SDA
IO0
  Top 0.508: R11.1 58.47,34.5 58.47,35.38
  Top 0.61: Q4.3 61.5,30.5 60.15,31.85 60.15,32.67 58.47,34.35 58.47,34.5 | R11.1 58.47,38.72 | 58.47,38.72 U1.25 | U$7.+ 60.53,38.72 58.47,38.72
LED_CONTROL
  Top 0.61: U1.16 45.55,35.2 46.75,34 52.25,34 61.5,24.75 R9.2
MIC_CONTROL
  Top 0.508: U$3.VCC 66.71,35.29 61.98,40.02 U1.26
MIC_OUT  (via drill 0.35)
  Top 0.508: v38.5,50 38.68,50.18 U1.5
  Bottom 0.508: U$3.OUT 66.87,40.37 61,34.5 39.5,34.5 38,36 38,49.5 v38.5,50
MQ2_AO  (via drill 0.35)
  Top 0.508: U1.4 36.55,51.45 v36,52
  Bottom 0.508: 39.17,64.44 R5.2 R4.1 35.53,52.47 v36,52
MQ2_DO
  Top 0.508: R1.1 64.95,64.6 R3.2 65,64.55 65,54.5 64.49,53.99 U1.37
N$1
  Top 1.27: U$4.- 53.8,26.27 Q2.3
N$2
  Top 0.406: R8.2 49.34,29.48 Q2.1
N$3
  Top 0.61: R1.2 48.94,66.5 U$2.DO
N$4
  Bottom 0.508: U$2.AO 35.53,72.13 R4.2
N$5
  Top 0.508: LED1.A 61.47,21.65 R9.1
N$6
  Top 0.61: R6.2 28.82,49.18 27.2,50.8 U$1.OUT
N$9
  Bottom 0.406: U$9.BS 36.3,89.55 C5.1
N$10
  Bottom 1.016: C5.2 38.15,91.8 U$9.SW
  Bottom 1.27: L1.1 53.2,91.8 49,96 41.5,96 38.5,93 C5.2
N$11
  Bottom 0.406: R15.1 32.15,91.8 U$9.EN
N$12
  Bottom 0.406: R13.1 34.5,87 34.05,87.45 U$9.FB 34.05,88.55 R14.2
N$13
  Top 0.61: R16.2 Q3.1
N$15  (via drill 0.35)
  Top 0.61: R17.1 66.05,25.55 v66,25.5 | v31,50.5 32.4,51.9 Q3.2
  Bottom 0.61: v66,25.5 58.5,33 37.5,33 30.5,40 30.5,50 v31,50.5
PHOTOTRAN
  Top 0.508: U1.8 38.87,46.37 38,45.5 38,42.03 R2.2 34,38.03 34,39.67 Q1.E
PHOTOTRAN_CONTROL
  Top 0.508: 34.62,41.5 Q1.C 35.45,41.45 36.5,42.5 36.5,45.5 38.64,47.64 U1.7
PIR_DO
  Top 0.406: 35.84,48.91 R7.2
  Top 0.508: U1.6 35.84,48.91
  Top 0.61: R6.1 33.35,48.1 33.46,48.1 R7.2
TEMP_CONTROL
  Top 0.508: U1.31 76.37,46.37 77,47 77,54.17 U$5.VIN
UART_PC_RX  (via drill 0.35)
  Top 0.61: JUM1.2 79.44,68.69 70,59.25 70,54.5 v69.25,53.75 | v66,51.5 58.55,51.5 U1.35
  Bottom 0.61: v69.25,53.75 67,51.5 v66,51.5
UART_PC_TX  (via drill 0.35)
  Top 0.61: JUM1.3 76.73,71.23 68,62.5 68,55 v67.5,54.5 | v61.5,50 60.75,50 60.5,50.25 58.57,50.25 U1.34
  Bottom 0.61: v67.5,54.5 63,50 v61.5,50
VIN
  Bottom 0.406: 35,92.8 U$9.IN 35,94.45 C8.1
  Bottom 1.016: K1.2 26.05,88.04 26.05,89.9 28.15,92 R15.2 30.05,92.8 31.75,94.5 C8.1

### Text on the board
tValues: SMOKE / SENSOR | HTU21D | PIR | MIC | PUSH / BUTTON | BUZZER
bText: Created at VSB / By Alexander Barsc / And Radim Hercik
topText: GND | VIN | GND | CTS | VCC | RX | TX | DTR
201bmp: C:/Users/Alex/Documents/GitHub/Diplomka/Diplomka/Diplomka/QRCode.bmp